# EAGLE design tinyduino-breakout-mk-3.0 (EAGLE 6.5.0)
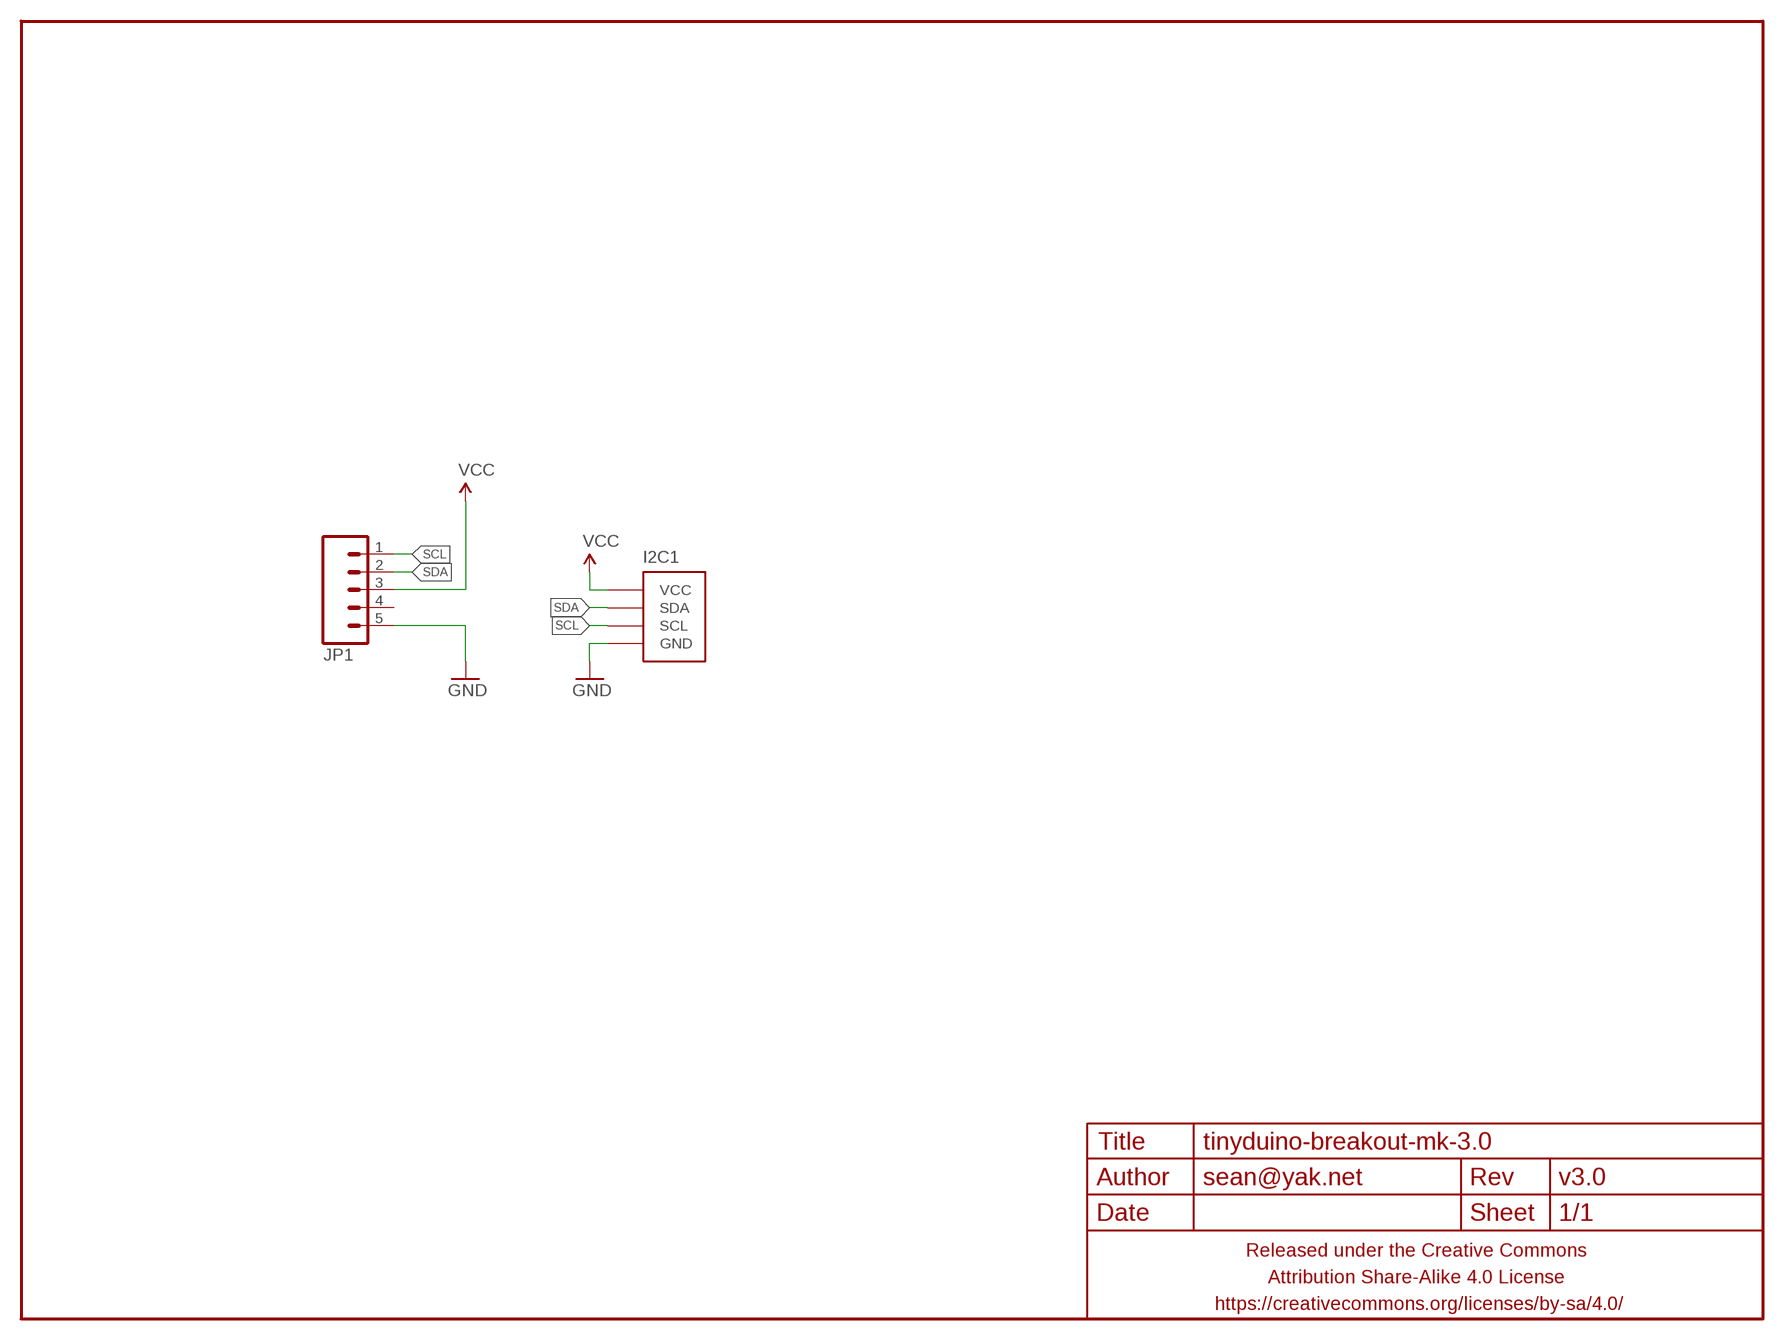
[diagram p0: schematic, sheet 1]

## Parts
FRAME1  FRAME-LETTERNO_PACKAGE  [DUMMY]
I2C1  M04-I2CTINYDUINO-CONNECTOR-REV  [DF12-32-DP-I2CONLY-REV]
JP1  M05SMD-SHORT  [1X05-SMD-SHORT]

## Nets
GND: I2C1.12(GND) I2C1.14(GND) JP1.5
SCL: I2C1.1(SCL) JP1.1
SDA: I2C1.3(SDA) JP1.2
VCC: I2C1.2(VCC) JP1.3
Unconnected: JP1.4

## Library data of the parts
FRAME1 = A_butts:FRAME-LETTER: Schematic Frame Standard 8.5x11 US Letter frame; DESIGNER: sean@yak.net; VERSION: v3.0
I2C1 = A_butts:M04-I2C
JP1 = A_butts:M05: Header 5 Standard 5-pin 0.1" header. Use with straight break away headers (SKU : PRT-00116), right angle break away headers (PRT-00553), swiss pins (PRT-00743), machine pins (PRT-00117), and female headers (PRT-00115). Molex polarized connector foot print use with SKU : PRT-08230 with associated crimp pins and housings.

## Board
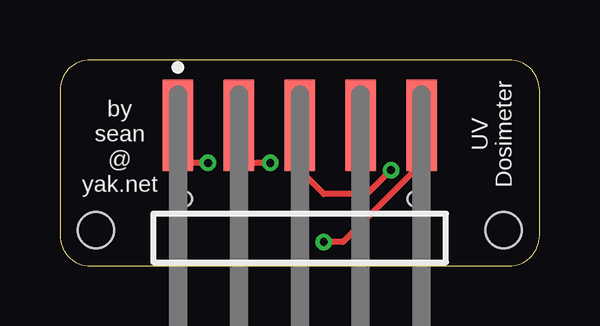
[diagram p1: board, top side]
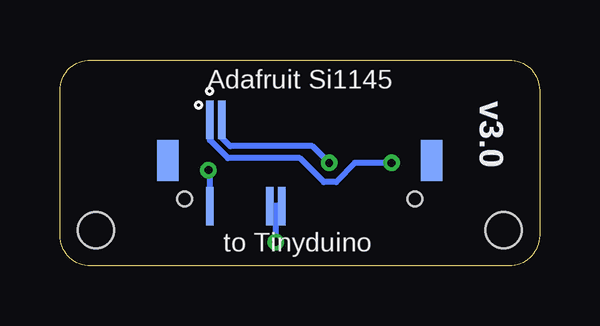
[diagram p2: board, bottom side, seen from below]

Size 20 x 8.6 mm. Coordinates in mm from the lower left corner, seen from the top.
Outline: 20,1.27 20,7.33 arc90 18.73,8.6 1.27,8.6 arc90 0,7.33 0,1.27 arc90 1.27,0 18.73,0 arc90 20,1.27
Copper layers (1*16): Top 0.0356mm / dielectric 1.5011mm / Bottom 0.0356mm
Design rules "LaenPCBOrder_2": minimum track width 6mil, minimum drill 13mil, track to track 6mil, track to pad 6mil, pad to pad 6mil, via to via 6mil, smd to smd 6mil, copper to edge 15mil, drill to drill 6mil, minimum pad ring 7mil, minimum via ring 7mil, stop-mask expansion 3mil, vias tented up to drill 20mil, thermal gap 10mil
Holes 1.5 mm at 1.5,1.5 18.5,1.5

### Footprints (pad centres in the part's own frame; a part is rotated, then mirrored left to right if it is on the bottom)
DF12-32-DP-I2CONLY-REV = smd 0.3 x 1.6 bottom: 1 3.75,1.8; 2 3.75,-1.8; 3 3.25,1.8; 12 1.25,-1.8; 14 0.75,-1.8 | smd 0.9 x 1.7 bottom: F1 5.5,0.1; F2 -5.5,0.1 | hole 0.6: 4.8,-1.5; -4.8,-1.5
1X05-SMD-SHORT = smd 1.27 x 3.81: 1 -5.08,3.175; 2 -2.54,3.175; 3 0,3.175; 4 2.54,3.175; 5 5.08,3.175

### Placement (x,y rotation side)
FRAME1  0,0 0 top
I2C1  10,4.3 0 top
JP1  10,2.7 0 top

### Tracks (layer width: path | path; a pad name or v marks a point on that pad's centre or on a via)
GND  (via drill 0.33)
  Top 0.25: JP1.5 15.08,4.28 11.8,1 v11,1
  Bottom 0.25: v11,1 11,2.5 | 11,2.5 I2C1.12 | I2C1.12 | I2C1.14 11,2.5 | 11,2.5
SCL  (via drill 0.33)
  Top 0.25: v6.17,4.3 5.1,4.3 4.92,4.48 JP1.1
  Bottom 0.25: v6.17,4.3 7.7,4.3 8.47,3.5 9,3.5 10,4.5 13,4.5 13.75,5.25 I2C1.1
SDA  (via drill 0.33)
  Top 0.25: 7.5,5.83 JP1.2 7.46,4.84 8,4.3 v8.77,4.3
  Bottom 0.25: v8.77,4.3 9.47,5 12.9,5 13.25,5.35 I2C1.3
VCC  (via drill 0.33)
  Top 0.25: v13.81,4 v13.81,4.01 12.8,3 11,3 10,4 JP1.3
  Bottom 0.25: I2C1.2 13.75,3.84 v13.81,4

### Text on the board
tPlace: UV | Dosimeter | by / sean / @ / yak.net
bPlace: Adafruit Si1145 | to Tinyduino